# EAGLE design PCB-BI8-SE-C201x (EAGLE 7.5.0)
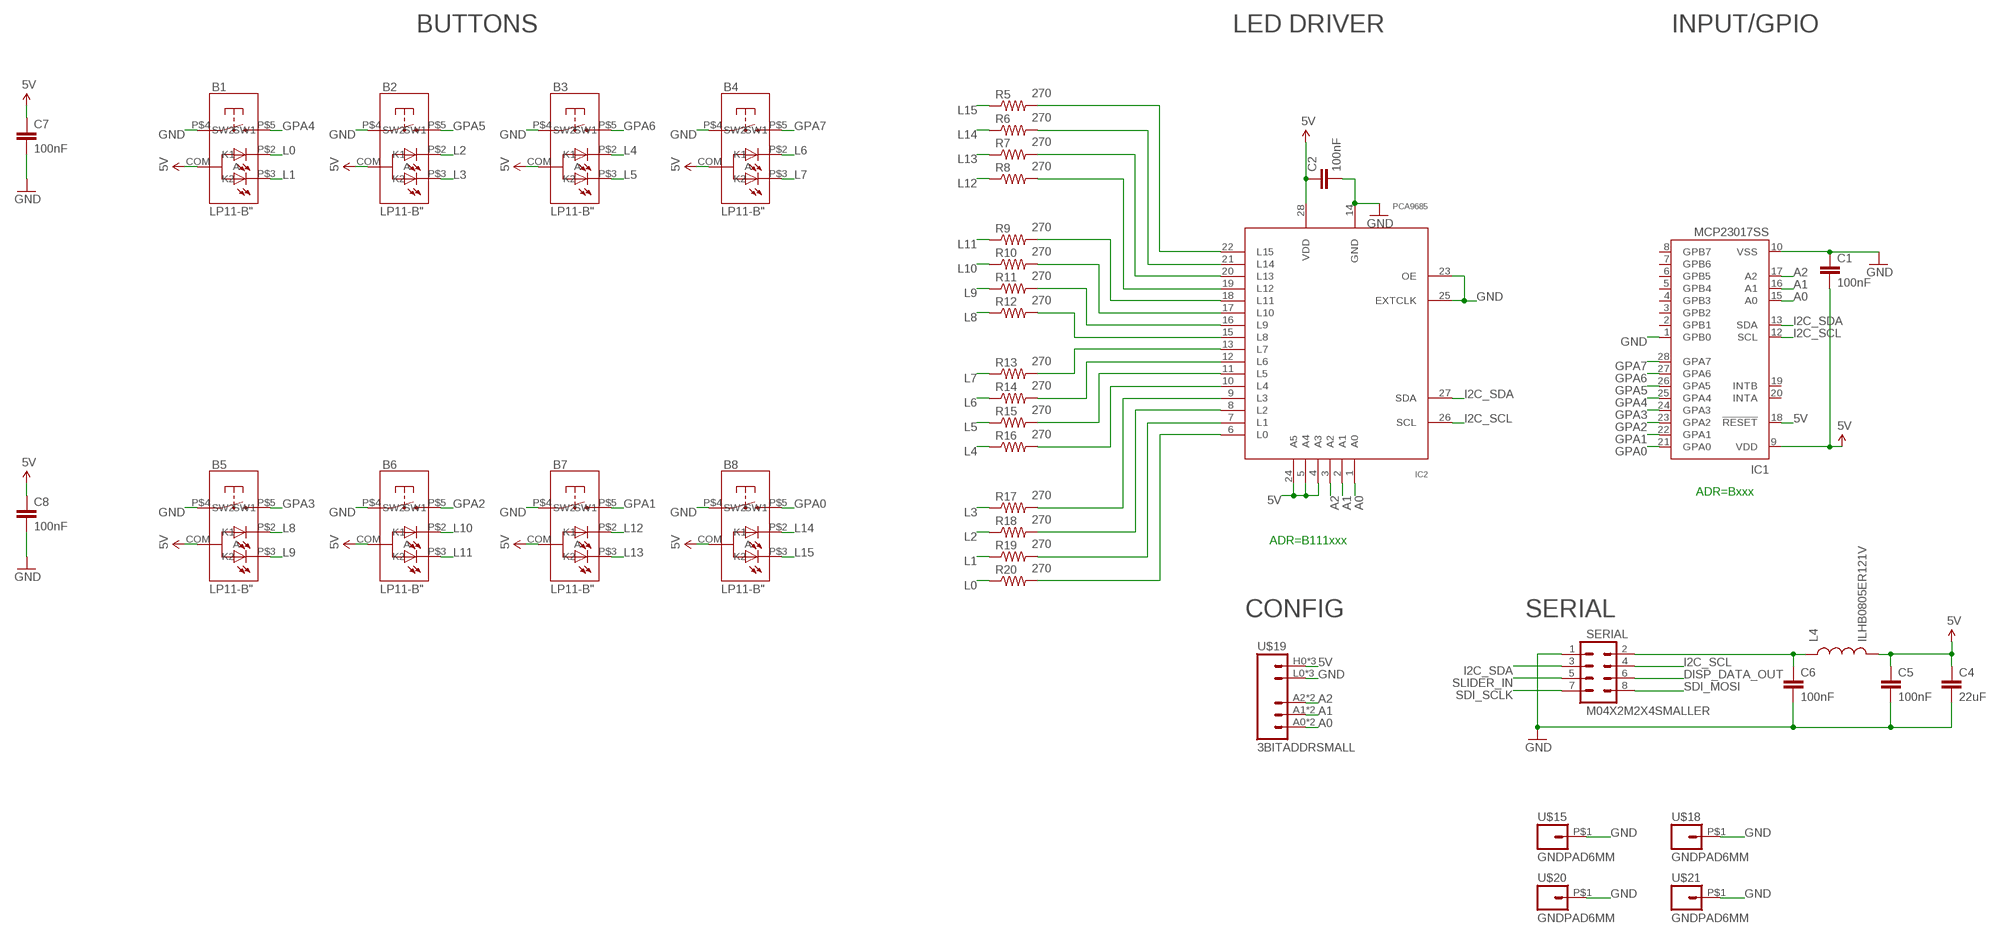
[diagram p0: schematic, sheet 1]

## Parts
B1  LP11-B"  [LP11]
B2  LP11-B"  [LP11]
B3  LP11-B"  [LP11]
B4  LP11-B"  [LP11]
B5  LP11-B"  [LP11]
B6  LP11-B"  [LP11]
B7  LP11-B"  [LP11]
B8  LP11-B"  [LP11]
C1  100nF  CAP0603-CAP  [0603-CAP]
C2  100nF  CAP0603-CAP  [0603-CAP]
C4  22uF  CAP0805  [0805]
C5  100nF  CAP0603-CAP  [0603-CAP]
C6  100nF  CAP0603-CAP  [0603-CAP]
C7  100nF  CAP0603-CAP  [0603-CAP]
C8  100nF  CAP0603-CAP  [0603-CAP]
IC1  MCP23017SS  [SSOP28]
IC2  PCA9685  [TSSOP28]
L4  ILHB0805ER121V  INDUCTOR0805  [0805]
R5  270  RESISTOR0603-RES  [0603-RES]
R6  270  RESISTOR0603-RES  [0603-RES]
R7  270  RESISTOR0603-RES  [0603-RES]
R8  270  RESISTOR0603-RES  [0603-RES]
R9  270  RESISTOR0603-RES  [0603-RES]
R10  270  RESISTOR0603-RES  [0603-RES]
R11  270  RESISTOR0603-RES  [0603-RES]
R12  270  RESISTOR0603-RES  [0603-RES]
R13  270  RESISTOR0603-RES  [0603-RES]
R14  270  RESISTOR0603-RES  [0603-RES]
R15  270  RESISTOR0603-RES  [0603-RES]
R16  270  RESISTOR0603-RES  [0603-RES]
R17  270  RESISTOR0603-RES  [0603-RES]
R18  270  RESISTOR0603-RES  [0603-RES]
R19  270  RESISTOR0603-RES  [0603-RES]
R20  270  RESISTOR0603-RES  [0603-RES]
SERIAL  M04X2M2X4SMALLER  [M2X4SMALLER]
U$15  GNDPAD6MM  [3.2MMPAD6MM]
U$18  GNDPAD6MM  [3.2MMPAD6MM]
U$19  3BITADDRSMALL  [3BITADDR_SMALL]
U$20  GNDPAD6MM  [3.2MMPAD6MM]
U$21  GNDPAD6MM  [3.2MMPAD6MM]

## Nets
5V [Power]: B1.COM(A) B2.COM(A) B3.COM(A) B4.COM(A) B5.COM(A) B6.COM(A) B7.COM(A) B8.COM(A) C1.2 C2.1 C4.1 C5.1 C7.1 C8.1 IC1.9(VDD) IC1.18(!RESET) IC2.4(A3) IC2.5(A4) IC2.24(A5) IC2.28(VDD) L4.2 U$19.H0(VCC) U$19.H1(VCC) U$19.H2(VCC)
A0: IC1.15(A0) IC2.1(A0) U$19.A0 U$19.AS0(A0)
A1: IC1.16(A1) IC2.2(A1) U$19.A1 U$19.AS1(A1)
A2: IC1.17(A2) IC2.3(A2) U$19.A2 U$19.AS2(A2)
DISP_DATA_OUT: SERIAL.6
GND [Power]: B1.P$4(SW1) B2.P$4(SW1) B3.P$4(SW1) B4.P$4(SW1) B5.P$4(SW1) B6.P$4(SW1) B7.P$4(SW1) B8.P$4(SW1) C1.1 C2.2 C4.2 C5.2 C6.2 C7.2 C8.2 IC1.1(GPB0) IC1.10(VSS) IC2.14(GND) IC2.23(OE) IC2.25(EXTCLK) SERIAL.1 U$15.P$1 U$18.P$1 U$19.L0(GND) U$19.L1(GND) U$19.L2(GND) U$20.P$1 U$21.P$1
GPA0: B8.P$5(SW2) IC1.21(GPA0)
GPA1: B7.P$5(SW2) IC1.22(GPA1)
GPA2: B6.P$5(SW2) IC1.23(GPA2)
GPA3: B5.P$5(SW2) IC1.24(GPA3)
GPA4: B1.P$5(SW2) IC1.25(GPA4)
GPA5: B2.P$5(SW2) IC1.26(GPA5)
GPA6: B3.P$5(SW2) IC1.27(GPA6)
GPA7: B4.P$5(SW2) IC1.28(GPA7)
I2C_SCL: IC1.12(SCL) IC2.26(SCL) SERIAL.4
I2C_SDA: IC1.13(SDA) IC2.27(SDA) SERIAL.3
L0: B1.P$2(K1) R20.1
L1: B1.P$3(K2) R19.1
L2: B2.P$2(K1) R18.1
L3: B2.P$3(K2) R17.1
L4: B3.P$2(K1) R16.1
L5: B3.P$3(K2) R15.1
L6: B4.P$2(K1) R14.1
L7: B4.P$3(K2) R13.1
L8: B5.P$2(K1) R12.1
L9: B5.P$3(K2) R11.1
L10: B6.P$2(K1) R10.1
L11: B6.P$3(K2) R9.1
L12: B7.P$2(K1) R8.1
L13: B7.P$3(K2) R7.1
L14: B8.P$2(K1) R6.1
L15: B8.P$3(K2) R5.1
N$1 [Power]: C6.1 L4.1 SERIAL.2
N$4: IC2.13(L7) R13.2
N$5: IC2.12(L6) R14.2
N$7: IC2.11(L5) R15.2
N$9: IC2.10(L4) R16.2
N$10: IC2.9(L3) R17.2
N$11: IC2.8(L2) R18.2
N$12: IC2.7(L1) R19.2
N$19: IC2.6(L0) R20.2
N$20: IC2.15(L8) R12.2
N$21: IC2.16(L9) R11.2
N$22: IC2.17(L10) R10.2
N$23: IC2.18(L11) R9.2
N$24: IC2.19(L12) R8.2
N$25: IC2.20(L13) R7.2
N$26: IC2.21(L14) R6.2
N$27: IC2.22(L15) R5.2
SDI_MOSI: SERIAL.8
SDI_SCLK: SERIAL.7
SLIDER_IN: SERIAL.5
Unconnected: IC1.2(GPB1) IC1.3(GPB2) IC1.4(GPB3) IC1.5(GPB4) IC1.6(GPB5) IC1.7(GPB6) IC1.8(GPB7) IC1.19(INTB) IC1.20(INTA)

## Notes on the sheet
- BUTTONS | LED DRIVER | INPUT/GPIO
- ADR=Bxxx
- ADR=B111xxx
- CONFIG | SERIAL

## Library data of the parts
B1-B8 = SKAARHOJ:LP11-B
C1 C2 C4-C8 = SparkFun:CAP: Capacitor Standard 0603 ceramic capacitor, and 0.1" leaded capacitor.
IC1 = microchip:MCP23017: http://ww1.microchip.com/downloads/en/DeviceDoc/21952a.pdf Source: http://ww1.microchip.com/downloads/en/DeviceDoc/21952a.pdf; MF: MICROCHIP; MPN: MCP23017-E/SS; OC_FARNELL: 1467674; OC_NEWARK: 31K2960
IC2 = wsmith:PCA9685
L4 = SparkFun:INDUCTOR: Inductors Basic Inductor/Choke - 0603 and 1206. Footprints are not proven and vary greatly between part numbers.
R5-R20 = SparkFun:RESISTOR: Resistor Basic schematic elements and footprints for 0603, 1206, and PTH resistors.
SERIAL = SKAARHOJ:M04X2
U$15 U$18 U$20 U$21 = SKAARHOJ:GNDPAD
U$19 = SKAARHOJ:3BITADDR

## Net classes
0 default: width 0.203 mm, drill 0.406 mm, clearance 0.203 mm
1 Power: width 0.406 mm, drill 0.61 mm, clearance 0.203 mm

## Board
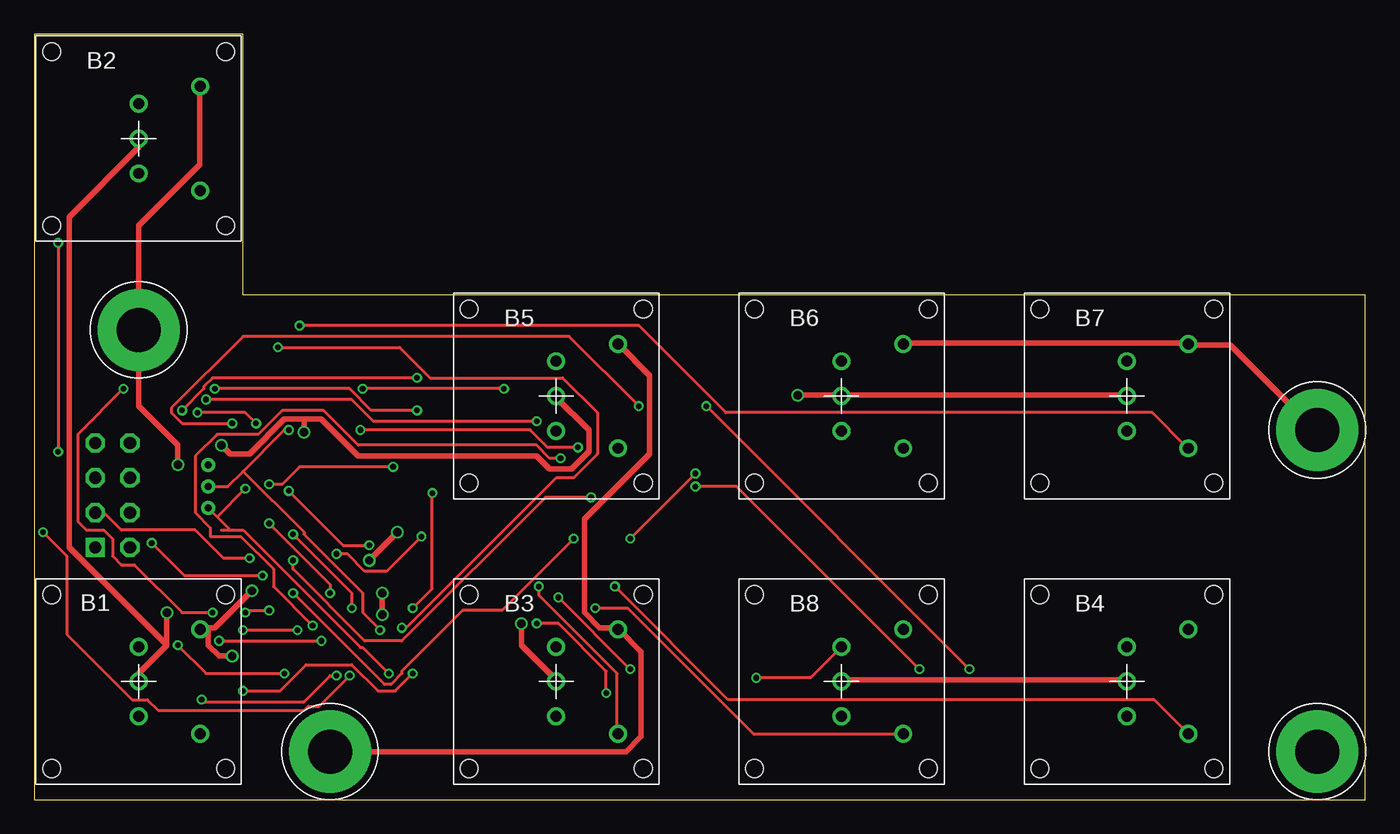
[diagram p1: board, top side]
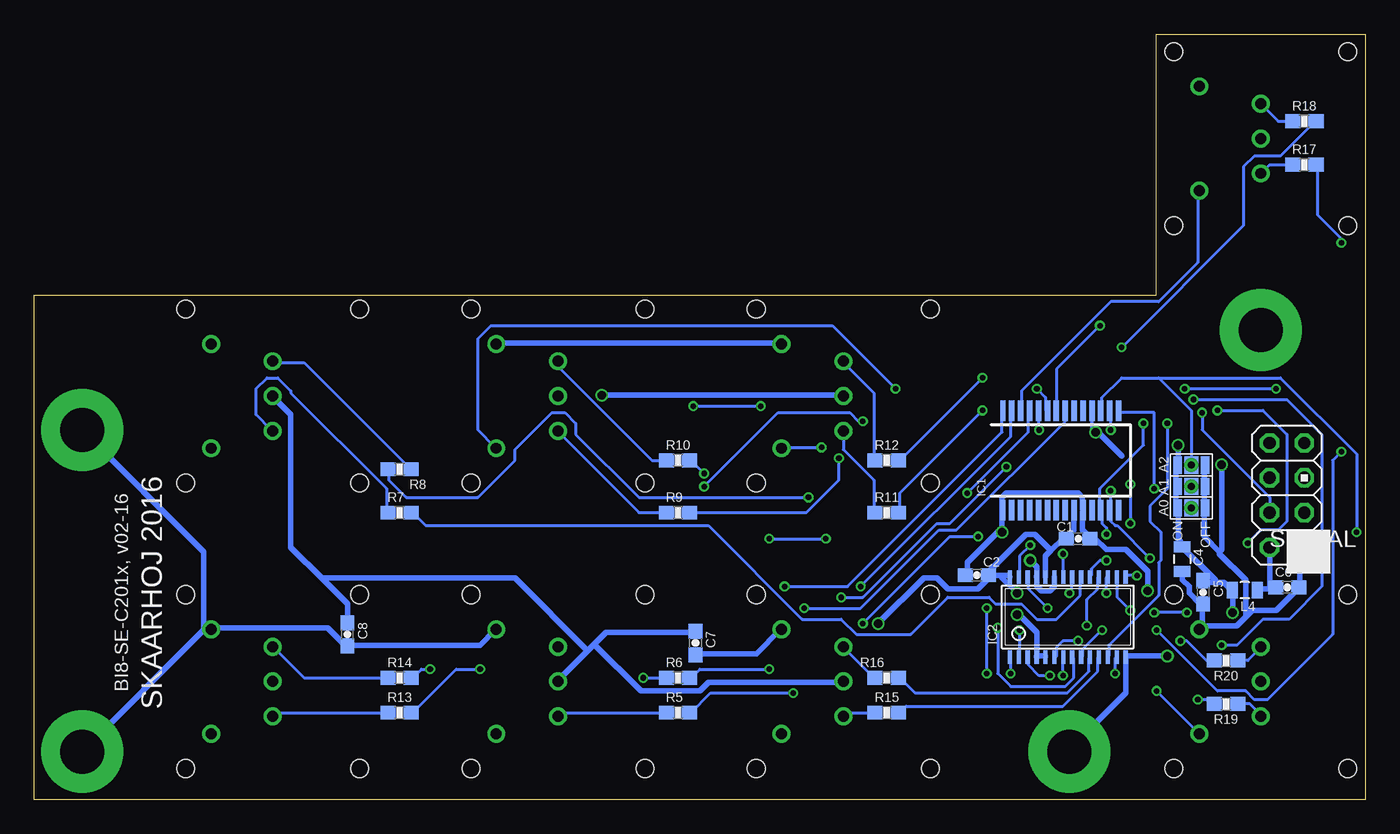
[diagram p2: board, bottom side, seen from below]

Size 97.16 x 55.88 mm. Coordinates in mm from the lower left corner, seen from the top.
Outline: 0,0 97.16,0 97.16,36.83 15.24,36.83 15.24,55.88 0,55.88 0,0
Copper layers (1*16): Top 0.035mm / dielectric 1.5mm / Bottom 0.035mm
Design rules "Fusion_eagle_rule_v1.1": minimum track width 6mil, minimum drill 12mil, track to track 6mil, track to pad 6mil, pad to pad 6mil, via to via 6mil, smd to smd 0mil, copper to edge 10mil, drill to drill 10mil, minimum pad ring 10mil, minimum via ring 6mil, stop-mask expansion 2mil, vias tented up to drill 100mil, thermal gap 10mil

### Footprints (pad centres in the part's own frame; a part is rotated, then mirrored left to right if it is on the bottom)
LP11 = drill 0.8: COM 0,0; P$2 0,2.54; P$3 0,-2.54; P$4 4.5,3.81; P$5 4.5,-3.81 | hole 1.3: -6.35,6.35; 6.35,6.35; 6.35,-6.35; -6.35,-6.35
0603-CAP = smd 1.1 x 1: 1 -0.85,0; 2 0.85,0
0805 = smd 0.8 x 1.2: 1 -0.9,0; 2 0.9,0
SSOP28 = smd 0.4 x 1.5: 1 -4.225,-3.625; 2 -3.575,-3.625; 3 -2.925,-3.625; 4 -2.275,-3.625; 5 -1.625,-3.625; 6 -0.975,-3.625; 7 -0.325,-3.625; 8 0.325,-3.625; 9 0.975,-3.625; 10 1.625,-3.625; 11 2.275,-3.625; 12 2.925,-3.625; 13 3.575,-3.625; 14 4.225,-3.625; 15 4.225,3.625; 16 3.575,3.625; 17 2.925,3.625; 18 2.275,3.625; 19 1.625,3.625; 20 0.975,3.625; 21 0.325,3.625; 22 -0.325,3.625; 23 -0.975,3.625; 24 -1.625,3.625; 25 -2.275,3.625; 26 -2.925,3.625; 27 -3.575,3.625; 28 -4.225,3.625
TSSOP28 = smd 0.305 x 0.991: 1 -4.225,-2.918; 2 -3.575,-2.918; 3 -2.925,-2.918; 4 -2.275,-2.918; 5 -1.625,-2.918; 6 -0.975,-2.918; 7 -0.325,-2.918; 8 0.325,-2.918; 9 0.975,-2.918; 10 1.625,-2.918; 11 2.275,-2.918; 12 2.925,-2.918; 13 3.575,-2.918; 14 4.225,-2.918; 15 4.225,2.918; 16 3.575,2.918; 17 2.925,2.918; 18 2.275,2.918; 19 1.625,2.918; 20 0.975,2.918; 21 0.325,2.918; 22 -0.325,2.918; 23 -0.975,2.918; 24 -1.625,2.918; 25 -2.275,2.918; 26 -2.925,2.918; 27 -3.575,2.918; 28 -4.225,2.918
0603-RES = smd 1.1 x 1: 1 -0.85,0; 2 0.85,0
M2X4SMALLER = drill 0.9 square: 1 -1.27,3.81 | drill 0.9 octagon: 2 1.27,3.81; 3 -1.27,1.27; 4 1.27,1.27; 5 -1.27,-1.27; 6 1.27,-1.27; 7 -1.27,-3.81; 8 1.27,-3.81
3.2MMPAD6MM = drill 3.2 pad 6: P$1 0,0
3BITADDR_SMALL = drill 0.5: A0 -1.565,0; A1 0,0; A2 1.565,0 | smd 1.27 x 1: AS0 -1.565,0; AS1 0,0; AS2 1.565,0 | smd 1.27 x 0.635: H0 -1.565,1; H1 0,1; H2 1.565,1; L0 -1.565,-1; L1 0,-1; L2 1.565,-1

### Placement (x,y rotation side)
B1  7.62,8.62 0 top
B2  7.62,48.26 0 top
B3  38.1,8.62 0 top
B4  79.76,8.62 0 top
B5  38.1,29.46 0 top
B6  58.93,29.46 0 top
B7  79.76,29.46 0 top
B8  58.93,8.62 0 top
C1  20.95,19.05 180 bottom
C2  28.35,16.38 180 bottom
C4  13.36,17.55 270 bottom
C5  11.84,15.14 270 bottom
C6  5.69,15.49 0 bottom
C7  48.9,11.43 270 bottom
C8  74.3,12.06 270 bottom
IC1  22.23,24.77 0 bottom
IC2  21.72,13.34 0 bottom
L4  8.79,15.29 180 bottom
R5  50.16,6.35 0 bottom
R6  50.16,8.89 0 bottom
R7  70.48,20.95 0 bottom
R8  70.48,24.13 180 bottom
R9  50.16,20.95 0 bottom
R10  50.16,24.77 0 bottom
R11  34.92,20.95 0 bottom
R12  34.92,24.77 0 bottom
R13  70.48,6.35 0 bottom
R14  70.48,8.89 0 bottom
R15  34.92,6.35 0 bottom
R16  34.92,8.89 0 bottom
R17  4.45,46.35 0 bottom
R18  4.45,49.53 0 bottom
R19  10.16,6.99 180 bottom
R20  10.16,10.16 180 bottom
SERIAL  5.71,22.23 180 bottom
U$15  7.62,34.29 0 top
U$18  21.59,3.5 0 top
U$19  12.7,22.86 90 bottom
U$20  93.66,3.5 0 top
U$21  93.66,26.98 0 top

### Tracks (layer width: path | path; a pad name or v marks a point on that pad's centre or on a via)
5V  (via drill 0.61)
  Top 0.406: v25.4,15.08 v25.4,13.49 | B4.COM 79.69,8.73 59.05,8.73 B8.COM | v35.56,12.86 35.56,11.27 38.1,8.73 B3.COM | B1.COM 7.62,9.21 9.68,11.27 9.68,11.43 | v9.68,13.65 9.68,11.43 | B2.COM 7.62,47.62 2.54,42.55 2.54,18.41 9.53,11.43 9.68,11.43 | v55.72,29.53 58.9,29.53 B6.COM 59.05,29.53 79.69,29.53 B7.COM | 19.68,27.78 20.95,27.78 23.65,25.08 36.67,25.08 37.62,24.13 39.21,24.13 40.48,25.4 40.48,26.99 38.1,29.37 B5.COM | 19.68,27.78 18.26,27.78 15.72,25.24 14.29,25.24 v13.65,25.88 | 19.68,27.78 v19.68,26.83
  Bottom 0.254: IC1.18 19.96,28.39 19.96,26.83 19.96,26.82
  Bottom 0.406: 22.94,18.18 22.07,19.05 C1.2 21.75,19.21 21.27,19.68 21.27,21.11 IC1.9 | 22.94,18.18 23.34,17.78 23.34,16.35 IC2.24 | IC2.5 23.34,10.48 23.97,10.48 IC2.4 23.97,10.64 23.97,12.22 25.24,13.49 v25.4,13.49 | 26.51,16.35 27.46,16.35 C2.1 | 26.51,16.35 26.04,16.35 IC2.28 | v25.4,15.08 26.51,16.19 26.51,16.35 | 22.94,18.18 24.13,19.37 24.77,19.37 27.62,16.51 C2.1 | 56.75,10.87 58.9,8.73 B8.COM | 56.75,10.87 56.28,11.35 | 56.28,11.35 55.4,12.22 48.9,12.22 C7.1 | 56.28,11.35 52.86,7.94 48.58,7.94 47.94,8.57 38.1,8.57 B3.COM | v35.56,12.86 32.23,16.19 31.27,16.19 30.48,15.4 28.26,15.4 27.46,16.19 C2.1 | 19.96,26.83 v19.68,26.83 19.53,26.83 17.78,25.08 | 10.95,15.88 10.32,15.88 9.84,15.4 L4.2 9.68,15.24 v9.68,13.65 | 10.95,15.88 11.75,15.88 C5.1 | 10.95,15.88 10.95,16.03 13.34,18.41 C4.1 13.49,18.57 13.49,18.89 13.65,18.89 13.65,21.11 U$19.H0 13.81,21.43 13.81,22.86 U$19.H1 13.81,23.02 13.81,24.29 U$19.H2 13.65,24.61 v13.65,25.88 | C8.1 74.3,14.29 76.12,16.11 | 76.12,16.11 78.42,18.41 78.42,28.1 79.69,29.37 B7.COM | v55.72,29.53 38.1,29.53 B5.COM | 56.75,10.87 62.07,16.19 76.04,16.19 76.12,16.11
A0  (via drill 0.41)
  Top 0.203: v25.88,9.21 23.97,11.11 23.81,11.11 15.24,19.68 14.29,19.68 | 13.65,19.68 14.29,19.68 | 14.29,19.68 13.34,20.64 | 13.34,20.64 12.7,21.27 U$19.AS0 | 13.34,20.64 v15.4,22.7
  Bottom 0.203: v25.88,9.21 25.88,10.32 IC2.1 | IC1.15 17.94,28.26 15.4,28.26 v15.4,22.7 | 12.7,21.27 U$19.AS0
A1  (via drill 0.41)
  Top 0.203: v25.24,12.38 23.97,13.65 23.97,15.08 19.68,19.37 19.68,19.53 15.24,23.97 | v18.57,26.99 18.26,26.99 15.24,23.97 | 15.24,23.97 14.13,22.86 U$19.AS1
  Bottom 0.203: v25.24,12.38 25.24,10.48 IC2.2 | v18.57,26.99 18.57,28.26 IC1.16
A2  (via drill 0.41)
  Top 0.203: v23.02,9.05 20.8,6.83 20,6.83 19.68,6.51 9.05,6.51 8.26,7.3 7.14,7.3 2.38,12.06 2.38,17.78 v0.64,19.53
  Bottom 0.203: v23.02,9.05 23.81,9.05 24.61,9.84 24.61,10.32 IC2.3 | v0.64,19.53 0.64,25.24 6.19,30.8 15.08,30.8 | 15.08,30.8 17.78,30.8 19.21,29.37 19.21,28.42 IC1.17 | U$19.AS2 12.7,28.42 15.08,30.8
GND  (via drill 0.61)
  Top 0.406: B2.P$4 12.06,52.07 12.06,46.35 7.62,41.91 U$15.P$1 7.62,28.73 10.48,25.88 v10.48,24.45 | v26.51,19.53 v24.45,17.46 | v15.88,15.24 13.18,12.54 12.22,12.54 B1.P$4 12.7,12.38 12.7,11.27 13.49,10.48 v14.45,10.48 | U$21.P$1 93.5,26.99 87.31,33.18 84.3,33.18 B7.P$4 84.14,33.34 63.5,33.34 B6.P$4 | B5.P$4 42.7,33.18 44.93,30.96 44.93,25.24 40.16,20.48 40.16,13.65 41.27,12.54 42.55,12.54 B3.P$4 42.7,12.38 44.29,10.79 44.29,4.6 43.18,3.49 U$18.P$1
  Bottom 0.406: IC2.23 22.7,16.19 22.7,15.56 23.02,15.24 23.65,15.24 23.97,15.56 23.97,16.19 IC2.25 23.97,16.35 23.97,16.99 v24.45,17.46 | 26.59,19.76 26.51,19.84 26.51,21.11 IC1.1 26.51,21.27 26.51,22.07 26.19,22.38 20.95,22.38 20.64,22.07 20.64,21.27 IC1.10 20.64,20.95 20.64,19.68 20.16,19.21 C1.1 19.68,19.05 18.89,18.26 17.46,18.26 15.88,16.67 v15.88,15.24 | 26.59,19.76 29.05,17.3 29.05,16.51 C2.2 | v26.51,19.53 26.51,19.68 26.59,19.76 | SERIAL.1 4.76,18.1 4.76,15.56 C6.2 4.92,15.4 6.51,13.81 8.26,13.81 8.65,13.41 | C4.2 13.34,16.51 13.34,16.03 12.86,15.56 12.86,15.08 12.06,14.29 C5.2 11.91,14.29 11.91,12.7 12.06,12.54 B1.P$4 11.75,12.7 9.37,12.7 8.65,13.41 | v14.45,10.48 17.3,10.48 IC2.14 17.46,10.32 17.46,7.78 21.59,3.65 U$18.P$1 | 8.65,13.41 8.73,13.49 8.73,16.03 10.64,17.94 10.64,18.1 | B8.P$4 63.5,12.38 64.61,11.27 74.3,11.27 C8.2 74.45,11.27 75.72,12.54 84.14,12.54 B4.P$4 | U$20.P$1 84.77,12.38 84.45,12.38 B4.P$4 | C7.2 48.9,10.64 44.45,10.64 42.7,12.38 B3.P$4 | B5.P$4 42.7,33.34 63.34,33.34 B6.P$4 | U$21.P$1 84.77,18.1 84.77,12.54 B4.P$4 | U$19.L2 11.75,24.29 11.75,23.02 U$19.L1 11.75,22.86 11.75,21.43 U$19.L0 11.75,21.11 11.75,19.21 10.64,18.1 | 10.64,18.1 10.48,18.26 v10.48,24.45
GPA0  (via drill 0.41)
  Top 0.203: v40.96,13.97 43.34,13.97 52.55,4.76 63.34,4.76 B8.P$5
  Bottom 0.203: v40.96,13.97 36.83,13.97 31.11,19.68 29.84,19.68 21.91,27.62 21.91,28.26 IC1.21
GPA1  (via drill 0.41)
  Top 0.203: v19.37,34.61 44.13,34.61 50.48,28.26 81.6,28.26 84.14,25.72 B7.P$5
  Bottom 0.203: v19.37,34.61 22.54,31.43 22.54,28.42 IC1.22
GPA2  (via drill 0.41)
  Top 0.203: v34.29,30 v23.97,30
  Bottom 0.203: v23.97,30 23.34,29.37 23.34,28.42 IC1.23 | v34.29,30 38.89,34.61 63.82,34.61 64.77,33.66 64.77,26.99 63.5,25.72 B6.P$5
GPA3  (via drill 0.41)
  Top 0.203: v23.81,26.99 36.2,26.99 37.47,25.72 v39.69,25.72
  Bottom 0.203: v23.81,26.99 23.81,28.26 IC1.24 | v39.69,25.72 42.55,25.72 B5.P$5
GPA4  (via drill 0.41)
  Top 0.203: v29.05,22.38 29.05,15.4 v27.62,13.97 | v27.62,9.21 26.35,7.94 25.08,7.94 23.18,9.84 19.84,9.84 17.94,7.94 v15.24,7.94
  Bottom 0.203: v29.05,22.38 24.61,26.83 24.61,28.26 IC1.25 | v27.62,9.21 v27.62,13.97 | v15.24,7.94 12.22,4.92 B1.P$5
GPA5
  Bottom 0.203: IC1.26 25.08,28.42 25.08,29.84 18.57,36.35 15.08,36.35 12.22,39.21 12.22,44.45 B2.P$5
GPA6  (via drill 0.41)
  Top 0.203: v36.83,15.56 36.83,14.92 42.55,9.21 42.55,4.92 B3.P$5
  Bottom 0.203: v36.83,15.56 25.88,26.51 25.88,28.26 IC1.27
GPA7  (via drill 0.41)
  Top 0.203: v42.39,15.56 50.64,7.3 81.76,7.3 84.14,4.92 B4.P$5
  Bottom 0.203: v42.39,15.56 37.78,15.56 26.51,26.83 26.51,28.26 IC1.28
I2C_SCL  (via drill 0.41)
  Top 0.203: v23.18,13.97 23.18,15.08 v18.89,19.37 | v11.91,28.26 15.4,28.26 v16.19,27.46
  Bottom 0.203: v23.18,13.97 24.61,15.4 24.61,16.19 IC2.26 | v18.89,19.37 18.89,19.84 19.21,20.16 19.21,21.11 IC1.12 19.37,21.27 19.37,22.7 16.19,25.88 v16.19,27.46 | v11.91,28.26 11.91,26.99 6.99,22.07 SERIAL.4
I2C_SDA  (via drill 0.41)
  Top 0.203: v24.45,18.57 22.54,18.57 v18.57,22.54 | SERIAL.3 5.08,20.95 6.35,19.68 11.75,19.68 13.81,17.62 v15.72,17.62
  Bottom 0.203: v24.45,18.57 25.24,17.78 25.24,16.35 IC2.27 | v18.57,22.54 18.57,21.27 IC1.13 18.57,21.11 18.57,20.32 18.26,20 18.1,20 v15.72,17.62
L0
  Bottom 0.203: R20.1 8.57,10.16 7.62,11.11 B1.P$2
L1
  Bottom 0.203: R19.1 8.41,6.99 7.62,6.19 B1.P$3
L2
  Bottom 0.203: R18.1 6.35,49.53 B2.P$2
L3
  Bottom 0.203: R17.1 6.99,46.35 B2.P$3
L4
  Bottom 0.203: R16.1 35.88,8.89 38.1,11.11 B3.P$2
L5
  Bottom 0.203: R15.1 37.94,6.35 38.1,6.19 B3.P$3
L6
  Bottom 0.203: R14.1 77.47,8.89 79.69,11.11 B4.P$2
L7
  Bottom 0.203: R13.1 79.53,6.35 79.69,6.19 B4.P$3
L8
  Bottom 0.203: R12.1 35.88,24.77 35.88,29.69 38.1,31.91 B5.P$2
L9
  Bottom 0.203: B5.P$3 38.1,25.56 35.88,23.34 35.88,20.95 R11.1
L10
  Bottom 0.203: R10.1 52.07,24.77 58.9,31.59 58.9,31.91 B6.P$2
L11
  Bottom 0.203: R9.1 53.02,20.95 58.9,26.83 B6.P$3
L12
  Bottom 0.203: R8.1 69.69,24.13 77.47,31.91 79.69,31.91 B7.P$2
L13
  Bottom 0.203: R7.1 71.44,20.95 71.44,22.7 78.42,29.69 78.42,29.84 79.38,30.8 80.17,30.8 80.96,30 80.96,28.1 79.85,26.99 B7.P$3
L14  (via drill 0.41)
  Top 0.203: v52.7,8.89 56.67,8.89 58.9,11.11 B8.P$2
  Bottom 0.203: v52.7,8.89 R6.1
L15
  Bottom 0.203: R5.1 58.74,6.35 58.9,6.19 B8.P$3
N$1
  Bottom 0.406: L4.1 7.78,15.4 6.67,15.4 C6.1 6.99,15.56 SERIAL.2
N$4  (via drill 0.41)
  Top 0.203: v18.26,9.21 12.54,9.21 v10.48,11.27 | v12.54,29.21 23.18,29.21 24.77,27.62 v36.67,27.62 | v48.26,22.86 51.28,22.86 v64.61,9.53
  Bottom 0.203: v18.26,9.21 18.26,10.32 IC2.13 | v10.48,11.27 9.37,11.27 7.46,13.18 5.56,13.18 3.17,15.56 3.17,26.67 5.71,29.21 v12.54,29.21 | v36.67,27.62 36.99,27.62 37.62,28.26 42.86,28.26 v48.26,22.86 | v64.61,9.53 66.36,9.53 69.53,6.35 R13.2
N$5  (via drill 0.41)
  Top 0.203: v44.13,28.73 39.05,33.81 15.24,33.81 10,28.57 10,28.26 10.79,27.46 v14.45,27.46 | v68.26,9.53 v49.05,28.73
  Bottom 0.203: v49.05,28.73 v44.13,28.73 | v68.26,9.53 68.9,9.53 69.53,8.89 R14.2 | IC2.12 18.73,10.48 18.73,11.27 15.08,14.92 15.08,17.3 14.92,17.46 14.92,19.53 15.72,20.32 15.72,21.43 14.45,22.7 v14.45,27.46
N$7
  Bottom 0.203: IC2.11 19.53,10.32 19.53,9.37 22.07,6.83 33.5,6.83 33.97,6.35 R15.2
N$9
  Bottom 0.203: IC2.10 20.16,10.32 20.16,9.37 21.75,7.78 32.86,7.78 33.97,8.89 R16.2
N$10  (via drill 0.41)
  Top 0.203: v15.24,12.38 v19.21,12.38 | v1.75,40.64 v1.75,25.4
  Bottom 0.203: v19.21,12.38 20.64,10.95 20.64,10.48 IC2.9 | v15.24,12.38 10.79,7.94 8.73,7.94 8.1,7.3 7.14,7.3 2.38,12.06 2.38,24.77 v1.75,25.4 | v1.75,40.64 1.75,40.96 3.49,42.7 3.49,46.35 R17.2
N$11  (via drill 0.41)
  Top 0.203: v26.83,12.54 27.15,12.54 38.1,23.5 39.37,23.5 41.12,25.24 41.12,28.26 38.58,30.8 28.89,30.8 26.67,33.02 v17.78,33.02
  Bottom 0.203: v26.83,12.54 26.83,9.21 25.88,8.26 21.91,8.26 21.27,8.89 21.27,10.32 IC2.8 | v17.78,33.02 8.89,41.91 8.89,46.2 8.1,46.99 6.19,46.99 3.65,49.53 R18.2
N$12  (via drill 0.41)
  Top 0.203: v22.07,9.05 21.59,9.05 19.68,7.14 12.38,7.14 v12.22,7.3
  Bottom 0.203: v22.07,9.05 22.07,10.32 IC2.7 | v12.22,7.3 11.43,7.3 11.11,6.99 R19.2
N$19  (via drill 0.41)
  Top 0.203: v13.49,11.59 v20.95,11.59
  Bottom 0.203: v20.95,11.59 22.07,11.59 22.54,11.11 22.54,10.48 IC2.6 | v13.49,11.59 13.02,11.59 11.59,10.16 R20.2
N$20  (via drill 0.41)
  Top 0.203: v16.67,16.35 10.95,16.35 v8.57,18.73 | v10.79,28.42 12.38,30 12.38,30.16 13.02,30.8 v27.94,30.8
  Bottom 0.203: v16.67,16.35 17.46,16.35 IC2.15 | v8.57,18.73 7.62,19.68 6.35,19.68 5.71,20.32 5.71,26.67 7.46,28.42 v10.79,28.42 | v27.94,30.8 33.97,24.77 R12.2
N$21  (via drill 0.41)
  Top 0.203: v17.14,13.81 15.56,13.81 v15.4,13.65 | v13.02,13.65 10.79,13.65 7.3,17.14 6.35,17.14 5.71,17.78 5.71,19.05 5.08,19.68 3.81,19.68 3.17,20.32 3.17,26.67 v6.51,30 | v13.18,30 23.02,30 24.61,28.42 v27.94,28.42
  Bottom 0.203: v17.14,13.81 18.1,14.76 18.1,16.19 IC2.16 | v13.02,13.65 v15.4,13.65 | v13.18,30 v6.51,30 | v27.94,28.42 33.97,22.38 33.97,20.95 R11.2
N$22  (via drill 0.41)
  Top 0.203: v18.89,15.08 25.56,8.41 26.04,8.41 26.83,9.21 26.83,9.37 31.27,13.81 34.13,13.81 v39.37,19.05 | v48.26,23.81 v43.5,19.05
  Bottom 0.203: v18.89,15.08 18.89,16.19 IC2.17 | v43.5,19.05 v39.37,19.05 | v48.26,23.81 49.21,24.77 R10.2
N$23  (via drill 0.41)
  Top 0.203: v20.32,12.7 17.46,15.56 17.46,16.83 15.08,19.21 12.86,19.21 12.86,19.84 11.75,20.95 11.75,25.08 13.34,26.67 16.35,26.67 18.1,28.42 21.11,28.42 23.65,25.88 36.67,25.88 37.62,24.92 v38.42,24.92
  Bottom 0.203: v20.32,12.7 20.32,14.61 19.53,15.4 19.53,16.19 IC2.18 | v38.42,24.92 38.42,23.34 40.8,20.95 R9.2
N$24  (via drill 0.41)
  Top 0.203: v18.89,17.46 18.89,16.83 24.13,11.59 26.83,11.59 37.31,22.07 v40.64,22.07
  Bottom 0.203: v18.89,17.46 19.37,17.46 20,16.83 20,16.35 IC2.19 | v40.64,22.07 53.02,22.07 57.63,26.67 57.63,27.46 58.42,28.26 59.37,28.26 62.07,25.56 62.07,24.77 64.77,22.07 70.01,22.07 71.28,23.34 71.28,24.13 R8.2
N$25
  Bottom 0.203: IC2.20 20.8,16.19 20.8,14.92 22.54,13.18 23.97,13.18 25.08,14.29 26.99,14.29 27.46,14.76 30.48,14.76 33.18,12.06 37.15,12.06 38.26,13.18 41.12,13.18 47.94,20 68.58,20 69.53,20.95 R7.2
N$26  (via drill 0.41)
  Top 0.203: v21.59,15.08 21.59,15.72 v17.14,20.16 | v17.14,23.02 18.1,23.02 19.37,24.29 v26.19,24.29 | v43.5,9.53 v38.26,14.76
  Bottom 0.203: v21.59,15.08 21.43,15.24 21.43,16.19 IC2.21 | v17.14,23.02 v17.14,20.16 | v26.19,24.29 30.32,20.16 31.27,20.16 36.67,14.76 v38.26,14.76 | v43.5,9.53 48.58,9.53 49.21,8.89 R6.2
N$27  (via drill 0.41)
  Top 0.203: v22.07,17.94 22.86,17.94 24.13,16.67 25.72,16.67 v28.26,19.21 | v36.67,12.86 38.26,12.86 41.75,9.37 v41.75,7.78
  Bottom 0.203: v22.07,17.94 22.07,16.35 IC2.22 | v28.26,19.21 30.32,19.21 v36.67,12.86 | v41.75,7.78 47.78,7.78 49.21,6.35 R5.2

### Text on the board
_bsilk: SKAARHOJ 2016 | BI8-SE-C201x, v02-16